# Altium schematic sheet Rectifier.SchDoc
size A4; SheetNumber: 5; SheetTotal: 9
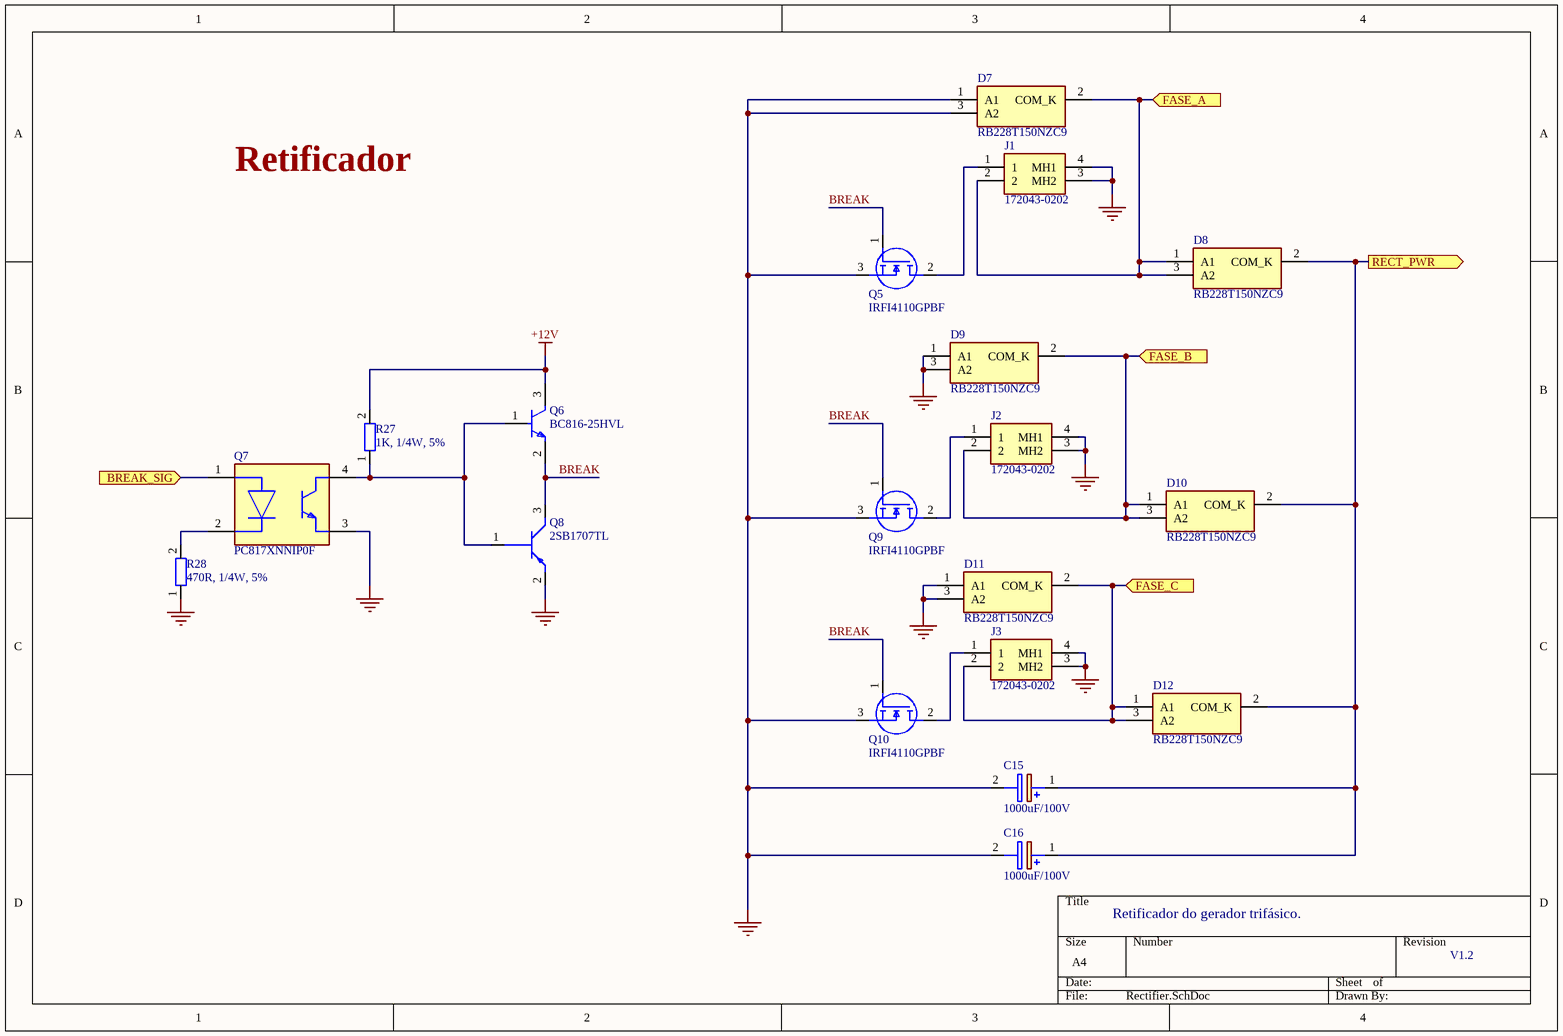
[diagram p0: Rectifier.SchDoc]

## Parts
C15  1000uF/100V  [CAPPRD750W85D1800H3750]
C16  1000uF/100V  [CAPPRD750W85D1800H3750]
D7  RB228T150NZC9  [TO254P480X1010X2100-3P]
D8  RB228T150NZC9  [TO254P480X1010X2100-3P]
D9  RB228T150NZC9  [TO254P480X1010X2100-3P]
D10  RB228T150NZC9  [TO254P480X1010X2100-3P]
D11  RB228T150NZC9  [TO254P480X1010X2100-3P]
D12  RB228T150NZC9  [TO254P480X1010X2100-3P]
J1  172043-0202  [1720430202]
J2  172043-0202  [1720430202]
J3  172043-0202  [1720430202]
Q5  IRFI4110GPBF  [TO254P483X1018X2095-3P]
Q6  BC816-25HVL  [FP-SOT23-IPC_C]
Q7  PC817XNNIP0F  [FP-PC817XNNIP0F-MFG]
Q8  2SB1707TL  [SOT95P280X100-3N]
Q9  IRFI4110GPBF  [TO254P483X1018X2095-3P]
Q10  IRFI4110GPBF  [TO254P483X1018X2095-3P]
R27  1K, 1/4W, 5%  [RES-0805]
R28  470R, 1/4W, 5%  [RES-0805]

## Ports
BREAK_SIG (in), FASE_A (in), FASE_B (in), FASE_C (in), RECT_PWR (out)

## Nets
+12V: Q6.3(C) R27.2
GND: C15.2(-) C16.2(-) D7.1(A1) D7.3(A2) D9.1(A1) D9.3(A2) D11.1(A1) D11.3(A2) J1.3(MH2) J1.4(MH1) J2.3(MH2) J2.4(MH1) J3.3(MH2) J3.4(MH1) Q5.3(S) Q7.3(E) Q8.2(E) Q9.3(S) Q10.3(S) R28.1
BREAK: Q5.1(G) Q6.2(E) Q8.3(C) Q9.1(G) Q10.1(G)
BREAK_SIG: Q7.1(A) ; port BREAK_SIG
FASE_A: D7.2(COM_K) D8.1(A1) D8.3(A2) J1.2 ; port FASE_A
FASE_B: D9.2(COM_K) D10.1(A1) D10.3(A2) J2.2 ; port FASE_B
FASE_C: D11.2(COM_K) D12.1(A1) D12.3(A2) J3.2 ; port FASE_C
RECT_PWR: C15.1(+) C16.1(+) D8.2(COM_K) D10.2(COM_K) D12.2(COM_K) ; port RECT_PWR
NetJ1_1: J1.1 Q5.2(D)
NetJ2_1: J2.1 Q9.2(D)
NetJ3_1: J3.1 Q10.2(D)
NetQ6_1: Q6.1(B) Q7.4(C) Q8.1(B) R27.1
NetQ7_2: Q7.2(C) R28.2

## Notes on the sheet
- Retificador
- Retificador do gerador trifásico.
- V1.2

## Library data of the parts
C15 C16 = ECA-2AHG102: Aluminum Electrolytic Capacitors - Leaded 1000uF 100V; Manufacturer_Name: Panasonic; Capacitance: 1mF; Tolerance: 20%; Ripple Current: 985mA; Leakage Current: 3uA; Life (Hours): 2000Hour; Dissipation Factor: 0.08%; Lead/Base Style: Straight; Lead Diameter: 0.8mm; Datasheet Link: http://www.mouser.com/ds/2/315/ABA0000C1215-1109177.pdf; Height: 37.5mm; Manufacturer_Part_Number: ECA-2AHG102; Mouser Part Number: 667-ECA-2AHG102; Mouser Price/Stock: https://www.mouser.co.uk/ProductDetail/Panasonic/ECA-2AHG102/?qs=rrcJgg%2Fw9KxYcZZHtVYgiQ%3D%3D; Arrow Part Number: ECA-2AHG102; Arrow Price/Stock: https://www.arrow.com/en/products/eca-2ahg102/panasonic; Supplier 1: Mouser; Supplier Part Number 1: 667-ECA-2AHG102; Manufacturer: Panasonic; Manufacturer Part Number: ECA-2AHG102; RoHS: Yes; Category: Aluminum Electrolytic Capacitors; Stock 1: 994; Pricing 1: 1=2.62000, 10=1.75000, 50=1.75000, 100=1.60000, 1000=1.07000, 10000=1.07000 (USD); Mount: Through Hole,PCB; Case/Package: Radial; Number of Pins: 2; Contact Plating: Tin; Min Operating Temperature: -55°C; Max Operating Temperature: 105°C; Termination: Radial; Voltage Rating: 100V; Packaging: Bulk; Package Quantity: 50; Voltage Rating (DC): 100V; Voltage: 100V; Series: NHG; Construction: RADIAL; Diameter: 18mm; Length: 35.5mm; Width: 18mm; Lead Pitch: 7.5mm; Height - Seated (Max): 1.476inch; Radiation Hardening: No; REACH SVHC: No SVHC; Lead Free: Lead Free; RoHS Compliant: Yes; ComponentLink1URL: https://datasheet.ciiva.com/2984/aba0000ce26-2984390.pdf?src-supplier=Avnet; ComponentLink1Description: https://datasheet.ciiva.com/2984/aba0000ce26-2984390.pdf?src-supplier=Avnet; ComponentLink2URL: https://datasheet.ciiva.com/43459/1790596-43459676.pdf?src-supplier=Farnell; ComponentLink2Description: https://datasheet.ciiva.com/43459/1790596-43459676.pdf?src-supplier=Farnell; ComponentLink3URL: https://datasheet.ciiva.com/24027/aba0000ce26-372437-24027279.pdf?src-supplier=Mouser; ComponentLink3Description: https://datasheet.ciiva.com/24027/aba0000ce26-372437-24027279.pdf?src-supplier=Mouser; ComponentLink4URL: https://datasheet.ciiva.com/30158/8aba0000ce26-30158524.pdf?src-supplier=Onlinecomponents.com; ComponentLink4Description: https://datasheet.ciiva.com/30158/8aba0000ce26-30158524.pdf?src-supplier=Onlinecomponents.com; ComponentLink5URL: https://datasheet.ciiva.com/16387/aba0000ce26-16387053.pdf?src-supplier=Future+Electronics; ComponentLink5Description: https://datasheet.ciiva.com/16387/aba0000ce26-16387053.pdf?src-supplier=Future+Electronics; ComponentLink6URL: https://datasheet.ciiva.com/14594/70067776-14594090.pdf?src-supplier=Allied+Electronics; ComponentLink6Description: https://datasheet.ciiva.com/14594/70067776-14594090.pdf?src-supplier=Allied+Electronics; ComponentLink7URL: https://datasheet.ciiva.com/15198/getdatasheetpartid-470872-15198006.pdf?src-supplier=Verical; ComponentLink7Description: https://datasheet.ciiva.com/15198/getdatasheetpartid-470872-15198006.pdf?src-supplier=Verical; ComponentLink8URL: https://datasheet.ciiva.com/17533/aba0000ce26-17533421.pdf?src-supplier=Avnet+Europe; ComponentLink8Description: https://datasheet.ciiva.com/17533/aba0000ce26-17533421.pdf?src-supplier=Avnet+Europe; ComponentLink9URL: https://datasheet.ciiva.com/29248/792491-da-01-en-elko-nhg-r-1000uf-100v-105c-29248620.pdf?src-supplier=Conrad; ComponentLink9Description: https://datasheet.ciiva.com/29248/792491-da-01-en-elko-nhg-r-1000uf-100v-105c-29248620.pdf?src-supplier=Conrad
D7-D12 = RB228T150NZC9: Schottky Diode; Manufacturer_Name: ROHM Semiconductor; Manufacturer: Rohm; Datasheet Link: https://fscdn.rohm.com/en/products/databook/datasheet/discrete/diode/schottky_barrier/rb228t150nz-e.pdf; Height: 4.8mm; Manufacturer_Part_Number: RB228T150NZC9; Supplier 1: Mouser; Supplier Part Number 1: 755-RB228T150NZC9; Manufacturer Part Number: RB228T150NZC9; RoHS: Yes; Stock 1: 982; Pricing 1: 1=1.74000, 10=1.48000, 50=1.48000, 100=1.14000, 1000=0.82400, 10000=0.78200 (USD)
J1-J3 = 172043-0202: CONN HDR 2POS 7.50MM R/A SLDR; Manufacturer_Name: Molex; Number of Positions: 2; Voltage Rating: 600V; Current Rating: 30A; Pitch: 0.295inch; Datasheet Link: https://www.molex.com/pdm_docs/sd/1720430202_sd.pdf; Height: 11.68mm; Manufacturer_Part_Number: 172043-0202; Mouser Part Number: 538-172043-0202; Mouser Price/Stock: https://www.mouser.co.uk/ProductDetail/Molex/172043-0202?qs=AUG1J5sL7zJwcA2Oseq0RA%3D%3D; Supplier 1: Mouser; Supplier Part Number 1: 538-172043-0202; Manufacturer: Molex; Manufacturer Part Number: 1720430202; RoHS: Yes; Category: Cables and Wire; Stock 1: 939; Pricing 1: 1=2.21000, 10=1.89000, 50=1.89000, 100=1.56000, 1000=1.22000, 10000=1.08000 (USD); Mount: Through Hole; Number of Pins: 2; Color: Black; Contact Material: Copper; Contact Plating: Silver; Insulation Material: Polymer; Min Operating Temperature: -40°C; Max Operating Temperature: 125°C; Packaging: Tray; Number of Rows: 1; Termination: Solder; Fastening Type: Ramp; Orientation: Right Angle; Number of Circuits: 2; RoHS Compliant: Yes; ComponentLink1URL: https://www.mouser.com/ds/2/276/1720430202_PCB_HEADERS-704499.pdf?src-supplier=Mouser; ComponentLink1Description: https://www.mouser.com/ds/2/276/1720430202_PCB_HEADERS-704499.pdf?src-supplier=Mouser; ComponentLink2URL: http://www.molex.com/pdm_docs/sd/1720430202_sd.pdf?src-supplier=Avnet; ComponentLink2Description: http://www.molex.com/pdm_docs/sd/1720430202_sd.pdf?src-supplier=Avnet; ComponentLink3URL: http://www.literature.molex.com/SQLImages/kelmscott/Molex/PDF_Images/987650-1349.PDF?src-supplier=Digi-Key; ComponentLink3Description: http://www.literature.molex.com/SQLImages/kelmscott/Molex/PDF_Images/987650-1349.PDF?src-supplier=Digi-Key; ComponentLink4URL: http://www.molex.com/pdm_docs/sd/1720430202_sd.pdf?src-supplier=Digi-Key; ComponentLink4Description: http://www.molex.com/pdm_docs/sd/1720430202_sd.pdf?src-supplier=Digi-Key
Q5 Q9 Q10 = IRFI4110GPBF: MOSFET N-CH 100V 72A TO220AB; Manufacturer_Name: Infineon; Rds On Max: 4.5mR; Input Capacitance: 9.54nF; Max Power Dissipation: 61W; Threshold Voltage: 4V; Datasheet Link: https://www.mouser.co.uk/datasheet/2/196/Infineon-IRFI4110G-DS-v01_02-EN-1227339.pdf; Height: 4.83mm; Manufacturer_Part_Number: IRFI4110GPBF; Mouser Part Number: 942-IRFI4110GPBF; Mouser Price/Stock: https://www.mouser.com/Search/Refine.aspx?Keyword=942-IRFI4110GPBF; Arrow Part Number: IRFI4110GPBF; Arrow Price/Stock: https://www.arrow.com/en/products/irfi4110gpbf/infineon-technologies-ag; Supplier 1: Mouser; Supplier Part Number 1: 942-IRFI4110GPBF; Manufacturer: Infineon; Manufacturer Part Number: IRFI4110GPBF; RoHS: Yes; Category: MOSFETs; Stock 1: 1795; Pricing 1: 1=3.31000, 10=2.79000, 50=2.63000, 100=2.25000, 1000=1.72000, 10000=1.59000 (USD); Mount: Through Hole; Case/Package: TO-220-3; Number of Pins: 3; Min Operating Temperature: -55°C; Max Operating Temperature: 175°C; Continuous Drain Current (ID): 72A; Packaging: Rail/Tube; Drain to Source Voltage (Vdss): 100V; Max Dual Supply Voltage: 100V; REACH SVHC: No SVHC; Lead Free: Lead Free; RoHS Compliant: Yes; Halogen Free: Halogen Free; ComponentLink1URL: http://www.infineon.com/dgdl/irfi4110gpbf.pdf?fileId=5546d462533600a401535623f28d1f78&src-supplier=Digi-Key; ComponentLink1Description: http://www.infineon.com/dgdl/irfi4110gpbf.pdf?fileId=5546d462533600a401535623f28d1f78&src-supplier=Digi-Key; ComponentLink2URL: http://www.farnell.com/datasheets/1302157.pdf?src-supplier=Element14; ComponentLink2Description: http://www.farnell.com/datasheets/1302157.pdf?src-supplier=Element14
Q6 = CMP-14406-000028-1: BC816-25H/SOT23/TO-236AB; Manufacturer: Nexperia; Supplier 1: Mouser; Supplier Part Number 1: 771-BC816-25HVL; Manufacturer Part Number: BC816-25HVL; RoHS: No; Stock 1: 11733; Pricing 1: 1=0.25000, 10=0.17100, 50=0.17100, 100=0.08300, 1000=0.04800, 10000=0.03200 (USD)
Q7 = CMP-65434-000005-1: OPTOISOLATOR 5KV TRANS 4SMD; Manufacturer: Sharp; Reverse Breakdown Voltage: 6V; Output Current per Channel: 30mA; Power Dissipation: 200mW; Collector-emitter Voltage-Max: 200mV; Max Output Voltage: 80V; Input Current: 50mA; Forward Voltage: 1.4V; Fall Time: 18000ns; Number of Elements: 1; Input Type: DC; Packaging: Tape and Reel; RoHS Compliant: Yes; Contact Plating: Copper; Min Operating Temperature: -30°C; Collector Emitter Saturation Voltage: 200mV; Max Input Current: 50mA; Radiation Hardening: No; Max Collector Current: 50mA; Case/Package: SMD/SMT; Mount: Surface Mount; Output Voltage: 80V; Forward Current: 50mA; Max Power Dissipation: 200mW; Collector Emitter Voltage (VCEO): 80V; Number of Channels: 1; Rise Time: 18000ns; Isolation Voltage: 5kV; Number of Pins: 4; Lead Free: Lead Free; Package Quantity: 2000; Isolation Voltage-Max: 5kV; Max Operating Temperature: 100°C; Supplier 1: Digi-Key; Supplier Part Number 1: 425-2774-1-ND; Manufacturer Part Number: PC817XNNIP0F; RoHS: Yes; Category: Optocouplers; REACH SVHC: Unknown; ComponentLink1URL: https://datasheet.ciiva.com/15119/getdatasheetpartid-299374-15119023.pdf?src-supplier=Verical; ComponentLink1Description: https://datasheet.ciiva.com/15119/getdatasheetpartid-299374-15119023.pdf?src-supplier=Verical; ComponentLink2URL: https://datasheet.ciiva.com/2086/pc817xxnip0f-series-2086507.pdf?src-supplier=Digi-Key; ComponentLink2Description: https://datasheet.ciiva.com/2086/pc817xxnip0f-series-2086507.pdf?src-supplier=Digi-Key; ComponentLink3URL: https://datasheet.ciiva.com/2086/pc817xxnip0f-series-2086508.pdf?src-supplier=Digi-Key; ComponentLink3Description: https://datasheet.ciiva.com/2086/pc817xxnip0f-series-2086508.pdf?src-supplier=Digi-Key; ComponentLink4URL: https://datasheet.ciiva.com/2086/pc817xxnip0f-series-2086509.pdf?src-supplier=Digi-Key; ComponentLink4Description: https://datasheet.ciiva.com/2086/pc817xxnip0f-series-2086509.pdf?src-supplier=Digi-Key; ComponentLink5URL: https://datasheet.ciiva.com/16475/pc817xnnip0f-16475911.pdf?src-supplier=Future+Electronics; ComponentLink5Description: https://datasheet.ciiva.com/16475/pc817xnnip0f-16475911.pdf?src-supplier=Future+Electronics; ComponentLink6URL: https://datasheet.ciiva.com/25900/pc817xxnip0f-series-25900837.pdf?src-supplier=Avnet+Europe; ComponentLink6Description: https://datasheet.ciiva.com/25900/pc817xxnip0f-series-25900837.pdf?src-supplier=Avnet+Europe; ComponentLink7URL: https://datasheet.ciiva.com/46396/1812378-46396954.pdf?src-supplier=Element14; ComponentLink7Description: https://datasheet.ciiva.com/46396/1812378-46396954.pdf?src-supplier=Element14; ComponentLink8URL: https://datasheet.ciiva.com/46435/1812378-46435723.pdf?src-supplier=Element14; ComponentLink8Description: https://datasheet.ciiva.com/46435/1812378-46435723.pdf?src-supplier=Element14
Q8 = 2SB1707TL: TRANS PNP 12V 4A TSMT3; Manufacturer_Name: ROHM Semiconductor; Manufacturer: Rohm; Max Power Dissipation: 500mW; Collector Base Voltage (VCBO): -15V; hFE Min: 270; Transition Frequency: 250MHz; Emitter Base Voltage (VEBO): -6V; Collector Emitter Saturation Voltage: -150mV; Element Configuration: Single; Continuous Collector Current: -4A; Max Frequency: 100MHz; Voltage Rating (DC): -12V; Collector-emitter Voltage-Max: 250mV; Datasheet Link: https://fscdn.rohm.com/en/products/databook/datasheet/discrete/transistor/bipolar/2sb1707tl-e.pdf; Height: 1mm; Manufacturer_Part_Number: 2SB1707TL; Mouser Part Number: 755-2SB1707TL; Mouser Price/Stock: https://www.mouser.com/Search/Refine.aspx?Keyword=755-2SB1707TL; Supplier 1: Mouser; Supplier Part Number 1: 755-2SB1707TL; Manufacturer Part Number: 2SB1707TL; RoHS: Yes; Category: BJTs; Stock 1: 2939; Pricing 1: 1=0.69000, 10=0.57100, 50=0.57100, 100=0.34600, 1000=0.29500, 10000=0.25200 (USD); Mount: Surface Mount; Case/Package: TO-236-3; Number of Pins: 3; Contact Plating: Copper,Tin,Silver; Min Operating Temperature: -55°C; Max Operating Temperature: 150°C; Collector Emitter Voltage (VCEO): 12V; Max Collector Current: 4A; Packaging: Tape and Reel; Package Quantity: 3000; Polarity: PNP; Collector Emitter Breakdown Voltage: 12V; Max Breakdown Voltage: 12V; Gain Bandwidth Product: 250MHz; Current Rating: -4A; Series: -; Length: 2.9mm; Width: 1.6mm; Radiation Hardening: No; Lead Free: Lead Free; RoHS Compliant: Yes; ComponentLink1URL: https://datasheet.ciiva.com/978/2sb1707-978075.pdf?src-supplier=Digi-Key; ComponentLink1Description: https://datasheet.ciiva.com/978/2sb1707-978075.pdf?src-supplier=Digi-Key; ComponentLink2URL: https://datasheet.ciiva.com/11203/2sb1707-11203670.pdf?src-supplier=Avnet; ComponentLink2Description: https://datasheet.ciiva.com/11203/2sb1707-11203670.pdf?src-supplier=Avnet; ComponentLink3URL: https://datasheet.ciiva.com/16289/2sb1707-210615-16289360.pdf?src-supplier=Mouser; ComponentLink3Description: https://datasheet.ciiva.com/16289/2sb1707-210615-16289360.pdf?src-supplier=Mouser; ComponentLink4URL: https://datasheet.ciiva.com/978/2sb1707-978076.pdf?src-supplier=Digi-Key; ComponentLink4Description: https://datasheet.ciiva.com/978/2sb1707-978076.pdf?src-supplier=Digi-Key; ComponentLink5URL: https://datasheet.ciiva.com/978/2sb1707-978077.pdf?src-supplier=Digi-Key; ComponentLink5Description: https://datasheet.ciiva.com/978/2sb1707-978077.pdf?src-supplier=Digi-Key
R27 = Res-0805: Res General Purpose Thick Film 0805 1k Ohm 5% 1/4W ±200ppm/°C Molded Paper T/R; Manufacturer_Name: YAGEO (PHYCOMP); Manufacturer_Part_Number: RC0805JR-131KL; Manufacturer: Yageo; Manufacturer Part Number: RC0805JR-7W1KL; Resistance: 1kR; Datasheet Link: http://www.yageo.com/documents/recent/PYu-RC_Group_51_RoHS_L_10.pdf; Height: 0.6mm; Mouser Part Number: 603-RC0805JR-131KL; Mouser Price/Stock: https://www.mouser.com/Search/Refine.aspx?Keyword=603-RC0805JR-131KL; Supplier 1: Mouser; Supplier Part Number 1: 603-RC0805JR-7W1KL; RoHS: Yes; Category: Resistors; Stock 1: 3681; Pricing 1: 1=0.17000, 10=0.10800, 50=0.10800, 100=0.03500, 1000=0.02500, 10000=0.01800 (USD); Case/Package: 0805; Tolerance: 5%; RoHS Compliant: Yes
R28 = Res-0805: Thick Film Resistors - SMD 470 OHM 5%; Manufacturer_Name: YAGEO (PHYCOMP); Manufacturer_Part_Number: RC0805JR-131KL; Manufacturer: Yageo; Manufacturer Part Number: RC0805JR-13470RL; Temperature Coefficient: 100ppm/°C; Power Rating: 125mW; Voltage Rating: 150V; Datasheet Link: http://www.yageo.com/documents/recent/PYu-RC_Group_51_RoHS_L_10.pdf; Height: 0.6mm; Mouser Part Number: 603-RC0805JR-131KL; Mouser Price/Stock: https://www.mouser.com/Search/Refine.aspx?Keyword=603-RC0805JR-131KL; Supplier 1: Mouser; Supplier Part Number 1: 603-RC0805JR-13470RL; RoHS: Yes; Category: Chip SMD Resistors; Stock 1: 48513; Pricing 1: 1=0.12000, 10=0.01700, 50=0.01700, 100=0.00600, 1000=0.00500, 10000=0.00400 (USD); Case/Package: 0805; Contact Plating: Tin,Matte; Case Code (Imperial): 0805; Case Code (Metric): 2012; Min Operating Temperature: -55°C; Max Operating Temperature: 155°C; Resistance: 470R; Tolerance: 5%; Resistor Type: Thick Film; Packaging: Tape and Reel; Termination: SMD/SMT; Series: RC; Construction: Rectangular; Length: 2mm; Width: 1.25mm; Depth: 1.25mm; Radiation Hardening: No; Military Standard: Not; RoHS Compliant: Yes; ComponentLink1URL: http://www.mouser.com/ds/2/447/Yageo_08112016_RC0805-968729.pdf?src-supplier=Mouser; ComponentLink1Description: http://www.mouser.com/ds/2/447/Yageo_08112016_RC0805-968729.pdf?src-supplier=Mouser; ComponentLink2URL: http://components.arrow.com/part/dataview/0323_04018308?src-supplier=Arrow+Europe; ComponentLink2Description: http://components.arrow.com/part/dataview/0323_04018308?src-supplier=Arrow+Europe; ComponentLink3URL: http://www.yageo.com/documents/recent/PYu-RC0805_51_RoHS_L-(4).pdf?src-supplier=Avnet+Europe; ComponentLink3Description: http://www.yageo.com/documents/recent/PYu-RC0805_51_RoHS_L-(4).pdf?src-supplier=Avnet+Europe